# Altium schematic sheet Power Supplies.SchDoc
size A; Engineer: Will Snyder; Revision: 1.0; SheetNumber: 4; SheetTotal: 5; DocumentTitle: Power Supplies
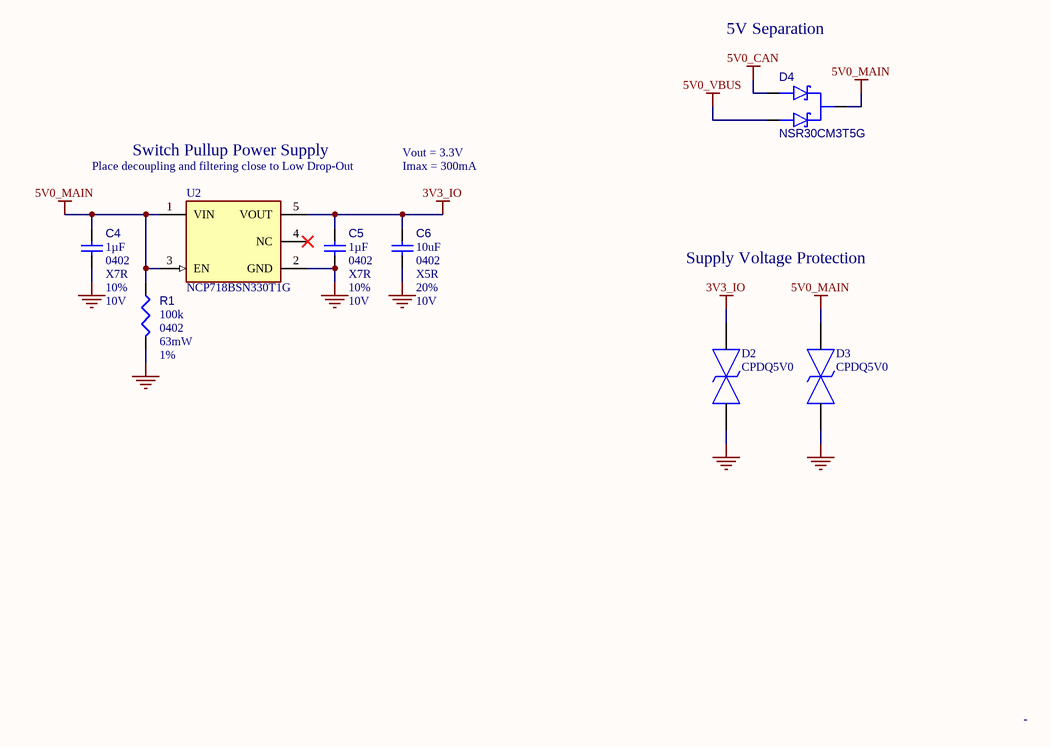
[diagram p0: Power Supplies.SchDoc]

## Parts
C4  value 1µF  Case/Package: 0402  Voltage Rating: 10V  Capacitor Type: X7R  Tolerance: 10%  [CAPC1005X55X30NL05T10]  (hidden comment: GRM155Z71A105KE01D)
C5  value 1µF  Case/Package: 0402  Voltage Rating: 10V  Capacitor Type: X7R  Tolerance: 10%  [CAPC1005X55X30NL05T10]  (hidden comment: GRM155Z71A105KE01D)
C6  value 10uF  Capacitor Type: X5R  Voltage Rating: 10V  Tolerance: 20%  Case/Package: 0402  [CAPC1005X55X30NL05T10]  (hidden comment: GRM155R61A106ME11J)
D2  CPDQ5V0  [MBTB-D-SOD-923F-IMP-0402]
D3  CPDQ5V0  [MBTB-D-SOD-923F-IMP-0402]
D4  NSR30CM3T5G  [ONSC-SOT-723-3-631AA-01_C_V]
R1  value 100k  Power: 63mW  Case/Package: 0402  Tolerance: 1%  [RESC0402(1005)_L]  (hidden comment: 100KR2F)
U2  NCP718BSN330T1G  [SOT95P280X100-5N]

## Nets
3V3_IO: C5.1 C6.1 D2.1(K) U2.5(VOUT)
5V0_CAN: D4.1(A1)
5V0_MAIN: C4.1 D3.1(K) D4.3(K) R1.1 U2.1(VIN) U2.3(EN)
5V0_VBUS: D4.2(A2)
GND: C4.2 C5.2 C6.2 D2.2(A) D3.2(A) R1.2 U2.2(GND)

Not connected (* = marked no-connect by the designer): U2 4(NC)*

## Notes on the sheet
- 5V Separation
- (near U2) Place decoupling and filtering close to Low Drop-Out
- Switch Pullup Power Supply
- Vout = 3.3V
- Imax = 300mA
- Supply Voltage Protection
- -

## Library data of the parts
C4 C5 = CMP-001-00092-1: Ceramic Capacitor, Multilayer, Ceramic, 10V, 10% +Tol, 10% -Tol, X7R, 15% TC, 1uF, Surface Mount, 0402; Mounting Technology: Surface Mount; Max Operating Temperature: 125°C; Pins: 2; RoHS Compliant: Yes; Min Operating Temperature: -55°C
C6 = CMP-001-00091-1: Ceramic Capacitor, Multilayer, Ceramic, 10V, 20% +Tol, 20% -Tol, X5R, 15% TC, 10uF, Surface Mount, 0402
D2 D3 = CMP-004-00042-2: 18.6V Clamp 9.4A (8/20Âµs) Ipp Tvs Diode Surface Mount 0402/SOD-923F; MF: Comchip Technology; Design Item ID: CPDQ5V0-HF; SnapEDA_Link: https://www.snapeda.com/parts/CPDQ5V0-HF/Comchip%20Technology/view-part/809934/?ref=snap; Component Type: Standard; Purchase-URL: https://pricing.snapeda.com/search/part/CPDQ5V0-HF/?ref=eda; Pins: 2; Availability: Good; Source: CPDQ5V0-HF.SchLib; Case/Package: 0402 Comchip; Price: None; MP: CPDQ5V0-HF; Check_prices: https://www.snapeda.com/parts/CPDQ5V0-HF/Comchip%20Technology/view-part/809934/?ref=eda; Value: *
D4 = CMP-004-00026-3: Dual Common Cathode Schottky Barrier Diodes, 3-Pin SOT-723, Pb-Free, Tape and Reel; ComponentLink1Description: Manufacturer URL; ComponentLink1URL: http://www.onsemi.com/; Mounting Technology: SMT; ComponentLink3Description: Package Specification; ComponentLink2URL: http://www.onsemi.cn/pub_link/Collateral/NSR30CM3T5G-D.PDF; ComponentLink3URL: http://www.onsemi.cn/pub_link/Collateral/BAT54M3-D.PDF; Pins: 3; ComponentLink2Description: Datasheet
R1 = CMP-009-00064-2: 100K 0.063W 1% 0402 (1005 Metric)  SMD; Mounting Technology: SMT; Pins: 2
U2 = CMP-019-00058-1: Fixed Positive LDO Regulator, 3.3V, 440V Dropout, PDSO5; RoHS Compliant: Yes